# EAGLE design debug_board_1 (EAGLE 9.6.2)
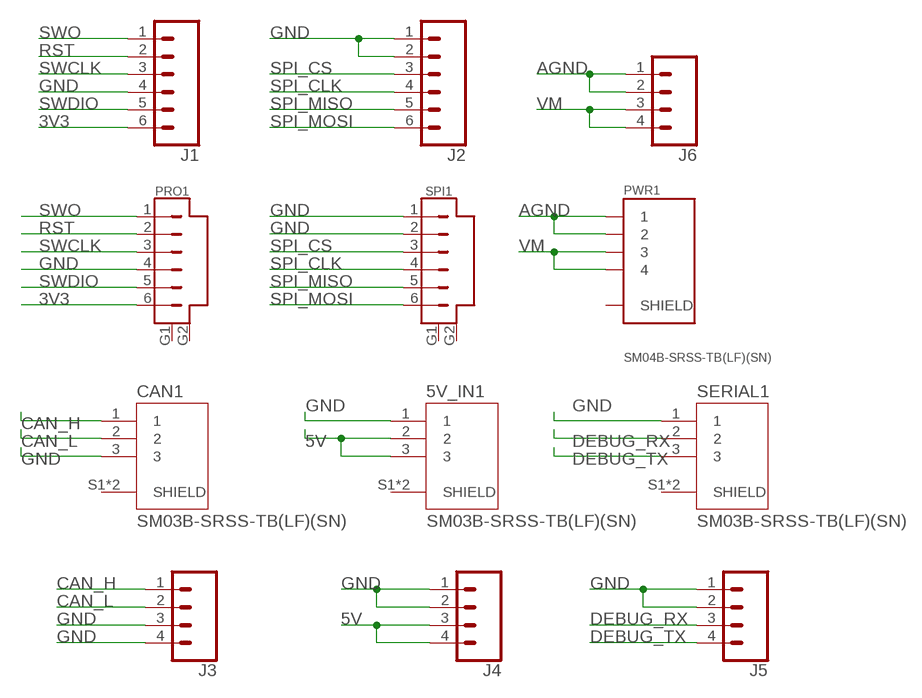
[diagram p0: schematic, sheet 1]

## Parts
5V_IN1  SM03B-SRSS-TB(LF)(SN)  [JST_SM03B-SRSS-TB(LF)(SN)]
CAN1  SM03B-SRSS-TB(LF)(SN)  [JST_SM03B-SRSS-TB(LF)(SN)]
J1  CONN_06LONGPADS  [1X06_LONGPADS]
J2  CONN_06LONGPADS  [1X06_LONGPADS]
J3  CONN_04LONGPADS  [1X04_LONGPADS]
J4  CONN_04LONGPADS  [1X04_LONGPADS]
J5  CONN_04LONGPADS  [1X04_LONGPADS]
J6  CONN_04LONGPADS  [1X04_LONGPADS]
PRO1  SM06B-SRSS-TB  [SM06B]
PWR1  SM04B-SRSS-TB(LF)(SN)  [JST_SM04B-SRSS-TB(LF)(SN)]
SERIAL1  SM03B-SRSS-TB(LF)(SN)  [JST_SM03B-SRSS-TB(LF)(SN)]
SPI1  SM06B-SRSS-TB  [SM06B]

## Nets
3V3: J1.6 PRO1.6
5V: 5V_IN1.2 5V_IN1.3 J4.3 J4.4
AGND: J6.1 J6.2 PWR1.1 PWR1.2
CAN_H: CAN1.1 J3.1
CAN_L: CAN1.2 J3.2
DEBUG_RX: J5.3 SERIAL1.2
DEBUG_TX: J5.4 SERIAL1.3
GND: 5V_IN1.1 CAN1.3 J1.4 J2.1 J2.2 J3.3 J3.4 J4.1 J4.2 J5.1 J5.2 PRO1.4 SERIAL1.1 SPI1.1 SPI1.2
RST: J1.2 PRO1.2
SPI_CLK: J2.4 SPI1.4
SPI_CS: J2.3 SPI1.3
SPI_MISO: J2.5 SPI1.5
SPI_MOSI: J2.6 SPI1.6
SWCLK: J1.3 PRO1.3
SWDIO: J1.5 PRO1.5
SWO: J1.1 PRO1.1
VM: J6.3 J6.4 PWR1.3 PWR1.4
Unconnected: 5V_IN1.S1(SHIELD) 5V_IN1.S2(SHIELD) CAN1.S1(SHIELD) CAN1.S2(SHIELD) PRO1.G1 PRO1.G2 PWR1.S1(SHIELD) PWR1.S2(SHIELD) SERIAL1.S1(SHIELD) SERIAL1.S2(SHIELD) SPI1.G1 SPI1.G2

## Library data of the parts
5V_IN1 CAN1 SERIAL1 = SM03B-SRSS-TB_LF__SN_:SM03B-SRSS-TB(LF)(SN): SH Series 3 Position 1 mm Pitch Surface Mount Side Entry Shrouded Header; AVAILABILITY: Unavailable; DESCRIPTION: Connector Header Surface Mount, Right Angle 3 position 0.039 _1.00mm_; MF: JST Sales; MP: SM03B-SRSS-TB_LF__SN_; PACKAGE: None; PRICE: None
J1 J2 = SparkFun-Connectors:CONN_06: Multi connection point. Often used as Generic Header-pin footprint for 0.1 inch spaced/style header connections On any of the 0.1 inch spaced packages, you can populate with these: Break Away Headers - Straight <https://www.sparkfun.com/products/116> (PRT-00116) Break Away Male Headers - Right Angle <https://www.sparkfun.com/products/553> (PRT-00553) Female Headers <https://www.sparkfun.com/products/115> (PRT-00115) Break Away Headers - Machine Pin <https://www.sparkfun.com/products/117> (PRT-00117) Break Away Female Headers - Swiss Machine Pin <https://www.sparkfun.com/products/743> (PRT-00743) Arduino Stackable Header - 6 Pin <https://www.sparkfun.com/products/9280> (PRT-09280) For SCREWTERMINALS and SPRING TERMINALS visit here: Screw Terimnals on SparkFun.com <https://www.sparkfun.com/search/results?term=Screw+Terminals> (5mm/3.5mm/2.54mm spacing) This device is also useful as a general connection point to wire up your design to another part of your project. Our various solder wires solder well into these plated through hole pads. Hook-Up Wire - Assortment (Stranded, 22 AWG) <https://www.sparkfun.com/products/11375> (PRT-11375) Hook-Up Wire - Assortment (Solid Core, 22 AWG) <https://www.sparkfun.com/products/11367> (PRT-11367) View the entire wire category on our website here <https://www.sparkfun.com/categories/141>
J3-J6 = SparkFun-Connectors:CONN_04: Multi connection point. Often used as Generic Header-pin footprint for 0.1 inch spaced/style header connections On any of the 0.1 inch spaced packages, you can populate with these: Break Away Headers - Straight <https://www.sparkfun.com/products/116> (PRT-00116) Break Away Male Headers - Right Angle <https://www.sparkfun.com/products/553> (PRT-00553) Female Headers <https://www.sparkfun.com/products/115> (PRT-00115) Break Away Headers - Machine Pin <https://www.sparkfun.com/products/117> (PRT-00117) Break Away Female Headers - Swiss Machine Pin <https://www.sparkfun.com/products/743> (PRT-00743) For SCREWTERMINALS and SPRING TERMINALS visit here: Screw Terimnals on SparkFun.com <https://www.sparkfun.com/search/results?term=Screw+Terminals> (5mm/3.5mm/2.54mm spacing) This device is also useful as a general connection point to wire up your design to another part of your project. Our various solder wires solder well into these plated through hole pads. Hook-Up Wire - Assortment (Stranded, 22 AWG) <https://www.sparkfun.com/products/11375> (PRT-11375) Hook-Up Wire - Assortment (Solid Core, 22 AWG) <https://www.sparkfun.com/products/11367> (PRT-11367) View the entire wire category on our website here <https://www.sparkfun.com/categories/141> Special notes: Molex polarized connector foot print use with SKU : PRT-08231 with associated crimp pins and housings. 1MM SMD Version SKU: PRT-10208; PROD_ID: CONN-09696
PRO1 SPI1 = SM06B-SRSS-TB:SM06B-SRSS-TB: CONN HEADER SH 6POS SIDE 1MM TIN Check prices <https://snapeda.com/parts/SM06B-SRSS-TB/JST%20Sales/view-part/?ref=eda>; AVAILABILITY: Bad; DESCRIPTION: Connector Header Surface Mount, Right Angle 6 position 0.039 (1.00mm); MF: JST Sales; MP: SM06B-SRSS-TB; PACKAGE: None; PRICE: None
PWR1 = SM04B-SRSS-TB_LF__SN_:SM04B-SRSS-TB(LF)(SN): SH Series 1.0 mm Pitch 2 Position Single Row Side Entry Shrouded Header Check prices <https://snapeda.com/parts/SM04B-SRSS-TB%28LF%29%28SN%29/JST%20Sales/view-part/?ref=eda>; ARROW_EUROPE-PURCHASE-URL: https://snapeda.com/shop?store=Arrow+Europe&id=557466; AVAILABILITY: Good; DESCRIPTION: Connector Header Surface Mount, Right Angle 4 position 0.039 (1.00mm); DIGIKEY-PURCHASE-URL: https://snapeda.com/shop?store=DigiKey&id=557466; MF: JST Sales; MP: SM04B-SRSS-TB(LF)(SN); PACKAGE: None; PRICE: None

## Board
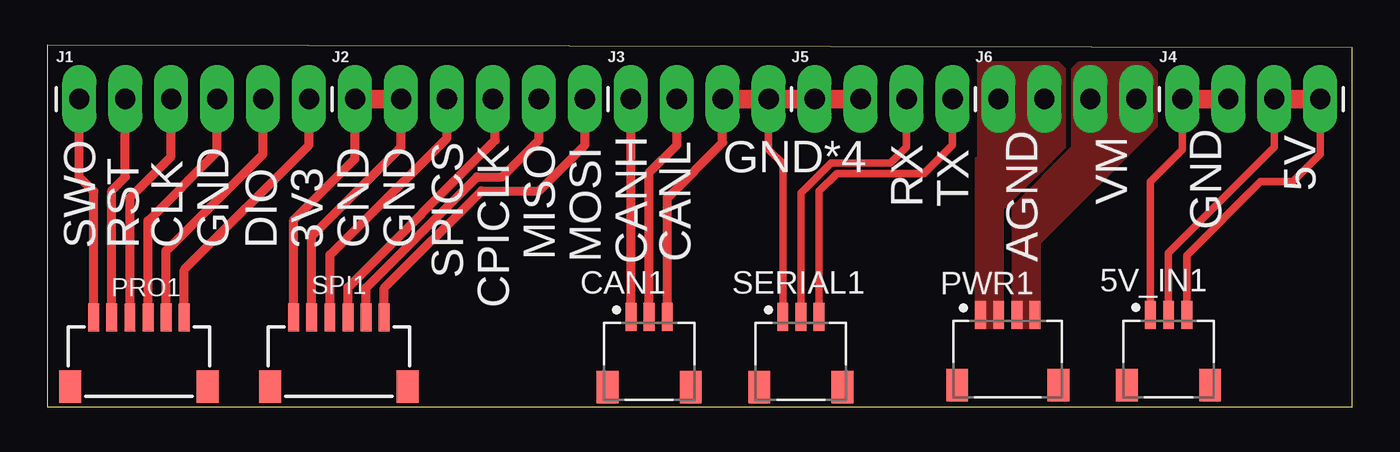
[diagram p1: board, top side]
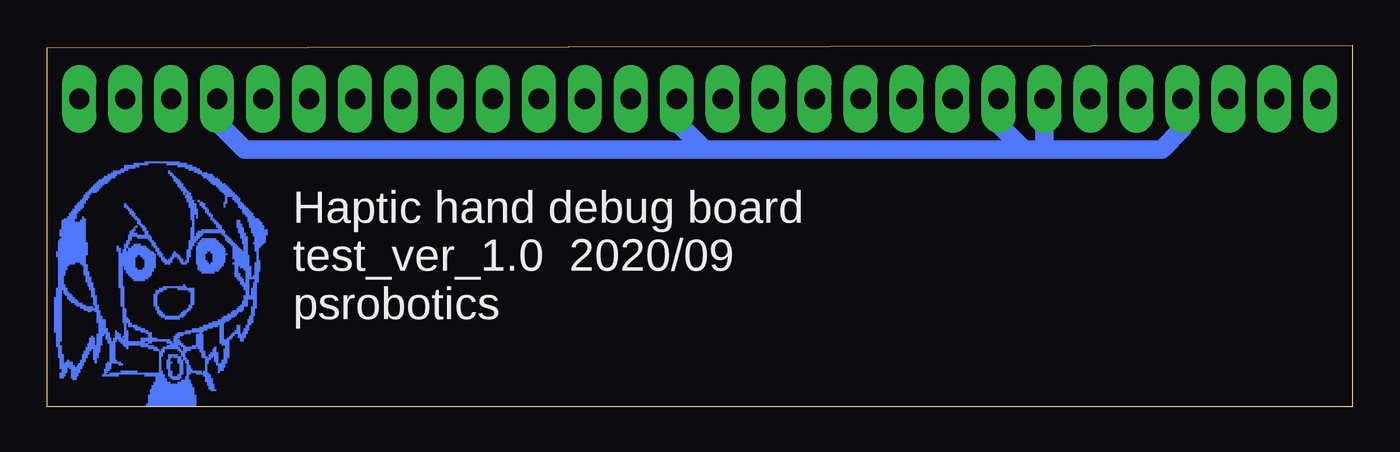
[diagram p2: board, bottom side, seen from below]

Size 72.12 x 19.99 mm. Coordinates in mm from the lower left corner, seen from the top.
Outline: 0,0 72.12,0 72.12,19.86 0,19.99 0,0
Copper layers (1*16): Top 0.035mm / dielectric 1.5mm / Bottom 0.035mm
Design rules "default *": minimum track width 6mil, minimum drill 0.35mm, track to track 6mil, track to pad 6mil, pad to pad 6mil, via to via 6mil, smd to smd 6mil, copper to edge 6mil, drill to drill 6mil, minimum pad ring 10mil, minimum via ring 8mil, stop-mask expansion 4mil, vias tented up to drill 12mil, thermal gap 10mil

### Footprints (pad centres in the part's own frame; a part is rotated, then mirrored left to right if it is on the bottom)
JST_SM03B-SRSS-TB(LF)(SN) = smd 0.6 x 1.55: 1 -1,0; 2 0,0; 3 1,0 | smd 1.2 x 1.8: S1 -2.3,-3.875; S2 2.3,-3.875
1X06_LONGPADS = drill 1.118 pad 1.88 long: 1 0,0; 2 2.54,0; 3 5.08,0; 4 7.62,0; 5 10.16,0; 6 12.7,0
1X04_LONGPADS = drill 1.118 pad 1.88 long: 1 0,0; 2 2.54,0; 3 5.08,0; 4 7.62,0
SM06B = smd 0.6 x 1.55: 1 -2.5,2.275; 2 -1.5,2.275; 3 -0.5,2.275; 4 0.5,2.275; 5 1.5,2.275; 6 2.5,2.275 | smd 1.2 x 1.8: G1 -3.8,-1.55; G2 3.8,-1.55
JST_SM04B-SRSS-TB(LF)(SN) = smd 0.6 x 1.55: 1 -1.5,0; 2 -0.5,0; 3 0.5,0; 4 1.5,0 | smd 1.2 x 1.8: S1 -2.8,-3.875; S2 2.8,-3.875

### Placement (x,y rotation side)
5V_IN1  61.98,5.08 0 top
CAN1  33.27,4.95 0 top
J1  1.78,17.02 0 top
J2  17.02,17.02 0 top
J3  32.26,17.02 0 top
J4  62.74,17.02 0 top
J5  42.42,17.02 0 top
J6  52.58,17.02 0 top
PRO1  5.08,2.67 0 top
PWR1  53.09,5.08 0 top
SERIAL1  41.66,4.95 0 top
SPI1  16.13,2.67 0 top
U$1  [SODAYO_1]  58.67,0 0 top

### Tracks (layer width: path | path; a pad name or v marks a point on that pad's centre or on a via)
3V3
  Top 0.508: PRO1.6 7.58,7.58 14.48,14.48 J1.6
5V
  Top 0.406: 5V_IN1.2 61.98,8.51 67.82,14.35 J4.3 | 5V_IN1.3 62.98,8.37 67.06,12.45 68.83,12.45 70.36,13.97 J4.4
  Top 1.016: J4.3 J4.4
AGND
  pour Top (no thermals): 51.44,19.05 55.88,19.05 56.26,18.67 56.26,14.35 52.83,10.92 52.83,4.32 51.31,4.32 51.31,13.72 51.44,13.84
CAN_H
  Top 0.508: CAN1.1 32.27,17 J3.1
CAN_L
  Top 0.508: CAN1.2 33.27,12.95 34.8,14.48 J3.2
DEBUG_RX
  Top 0.406: SERIAL1.2 41.66,11.81 43.31,13.46 46.61,13.46 47.5,14.35 J5.3
DEBUG_TX
  Top 0.406: SERIAL1.3 42.66,11.92 43.64,12.9 48.46,12.9 50.04,14.48 J5.4
GND
  Top 0.406: SERIAL1.1 40.66,13.45 39.88,14.22 J3.4 | 5V_IN1.1 60.98,12.46 62.74,14.22 J4.1
  Top 0.508: PRO1.4 5.58,10.28 9.4,14.1 J1.4 | SPI1.1 13.63,10.33 17.02,13.72 J2.1 | SPI1.2 14.63,9.42 19.56,14.35 J2.2 | CAN1.3 34.27,11.54 37.34,14.61 J3.3
  Top 1.016: J3.3 J3.4 J5.1 J5.2 | J2.1 J2.2 | J4.1 J4.2
  Bottom 1.016: J1.4 9.4,15.37 10.54,14.22 17.02,14.22 | 17.02,14.22 18.16,14.22 | 18.16,14.22 19.56,15.62 J2.2 | J2.1 17.02,14.22 | J3.3 37.34,15.75 35.81,14.22 | 35.81,14.22 18.16,14.22 | 35.81,14.22 61.21,14.22 62.74,15.75 J4.1
RST
  Top 0.508: PRO1.2 3.58,11.96 4.32,12.7 J1.2
SPI_CLK
  Top 0.508: SPI1.4 16.63,6.6 24.77,14.73 24.77,16.89 J2.4
SPI_CS
  Top 0.508: SPI1.3 15.63,8.39 22.1,14.86 J2.3
SPI_MISO
  Top 0.508: SPI1.5 17.63,6.58 23.75,12.7 25.15,12.7 27.18,14.73 J2.5
SPI_MOSI
  Top 0.508: SPI1.6 18.63,6.56 24,11.94 27.18,11.94 29.72,14.48 J2.6
SWCLK
  Top 0.508: PRO1.3 4.58,11.56 6.86,13.84 J1.3
SWDIO
  Top 0.508: PRO1.5 6.58,8.61 11.94,13.97 J1.5
SWO
  Top 0.508: PRO1.1 2.58,11.9 1.78,12.7 J1.1
VM
  pour Top (no thermals): 53.34,4.32 53.34,11.05 56.64,14.35 56.64,18.67 57.02,19.05 60.83,19.05 61.09,18.8 61.34,18.54 61.34,15.49 55.75,9.91 54.86,9.02 54.86,4.32

### Text on the board
tPlace: GND*4 | 5V | RX | TX | VM | GND | SWO | RST | CLK | GND | DIO | 3V3 | GND | GND | MISO | MOSI | CANH | CANL | AGND | SPICS | CPICLK
bPlace: Haptic hand debug board / test_ver_1.0 2020/09 / psrobotics
tStop: APT_B / PS